# Altium schematic sheet SoftCore_SA_P1.SchDoc: =ProjectTitle
size B; Engineer: Hab S Collector; Address1: 3621 Gin Way; Address2: Snellville GA, 30039; SheetNumber: 1; SheetTotal: 7
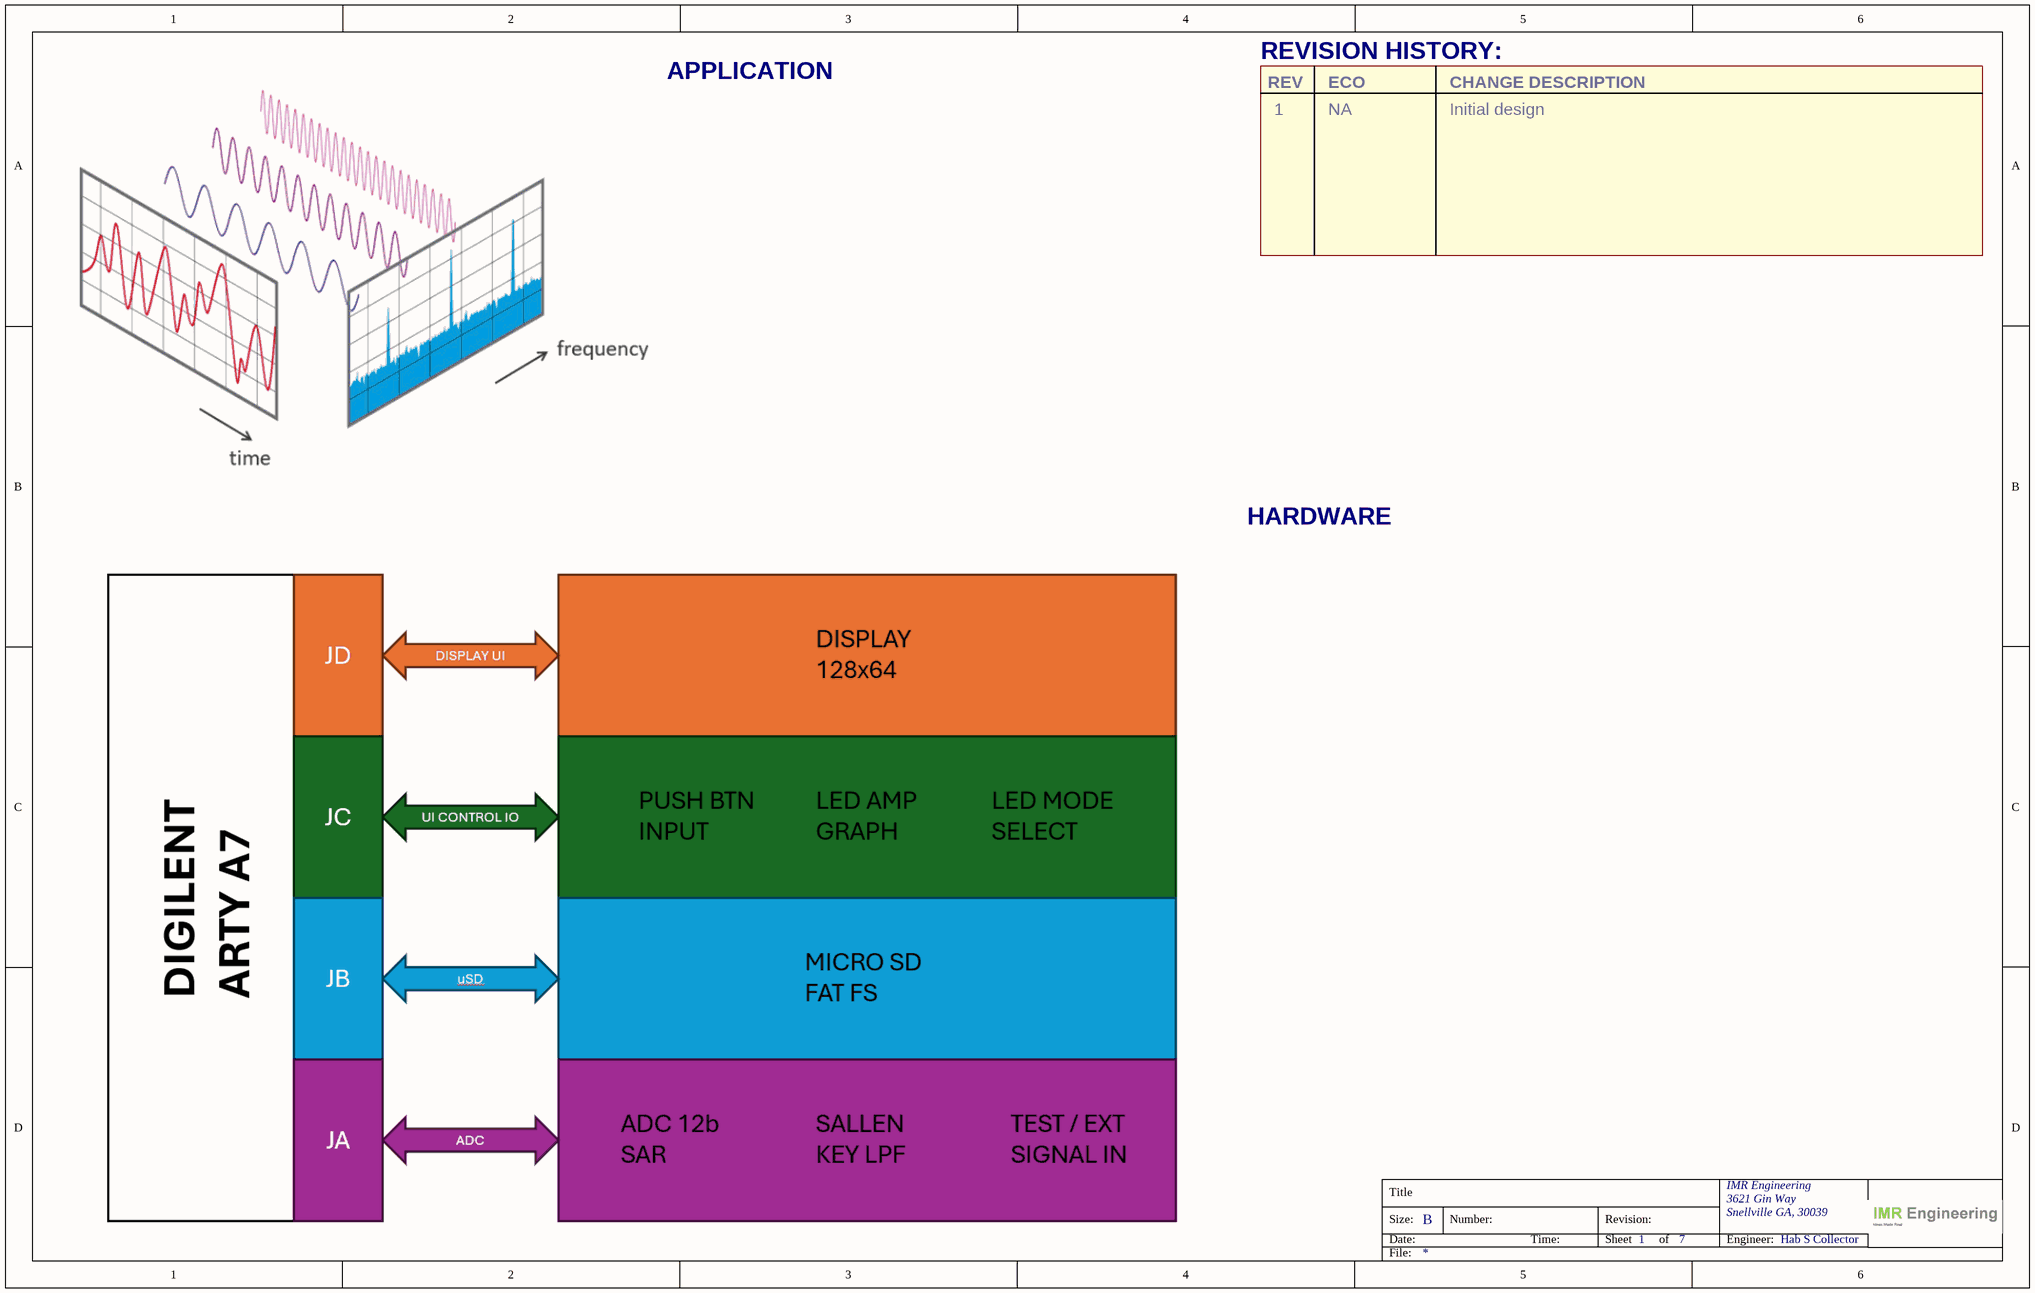
[diagram p0: SoftCore_SA_P1.SchDoc]

## Notes on the sheet
- APPLICATION
- REVISION HISTORY:
- REV
- ECO
- CHANGE DESCRIPTION
- 1
- NA
- Initial design
- HARDWARE
- Title
- Size:
- Date:
- B
- Number:
- Time:
- Revision:
- Sheet
- of
- IMR Engineering
- Engineer:
- File: